# Altium schematic sheet TP2.SchDoc
size A
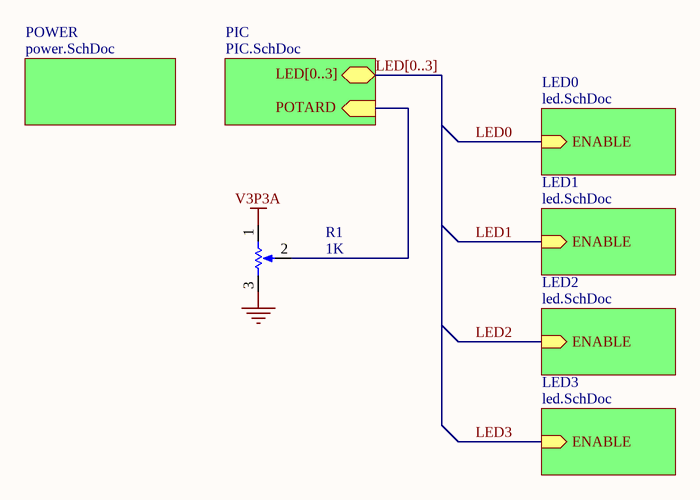
[diagram p0: TP2.SchDoc]

## Parts
R1  1K  [PDB181-K415K-102A2]

## Sub-sheets
LED0 = led.SchDoc: ENABLE (in)
LED1 = led.SchDoc: ENABLE (in)
LED2 = led.SchDoc: ENABLE (in)
LED3 = led.SchDoc: ENABLE (in)
PIC = PIC.SchDoc: no entries
POWER = power.SchDoc: no entries

## Ports


## Nets
GND: R1.3(TOP)
V3P3A: R1.1(BOT)
LED0: sheet LED0/ENABLE
LED1: sheet LED1/ENABLE
LED2: sheet LED2/ENABLE
LED3: sheet LED3/ENABLE
LED[0..3]: R1.2(TAP) ; port 

## Buses and harness runs
bus LED[0..3]
bus LED[0..3] = port 

## Notes on the sheet
- Labels drawn without touching a wire or pin: LED[0..3], POTARD

## Library data of the parts
R1 = RPot: Potentiometer; Sim Note: Enter the Resistance value and the set point into parameter fields.; Set Position: 0.5; Fabricant: BOURNS; Fournisseur: Farnell; RefFournisseur: 1823540; Published: 8-Jun-2000; LatestRevisionDate: 17-Jul-2002; LatestRevisionNote: Re-released for DXP Platform.; PackageReference: VR5; Publisher: Altium Limited; PackageDescription: Variable Resistor, Thru-Hole; 3 Leads; RefFabricant: PDB181-K415K-102A2